# Altium schematic sheet clock-distribution.SchDoc: Clock Distribution
size A3; DocumentNumber: 8; SheetNumber: 8; SheetTotal: 9
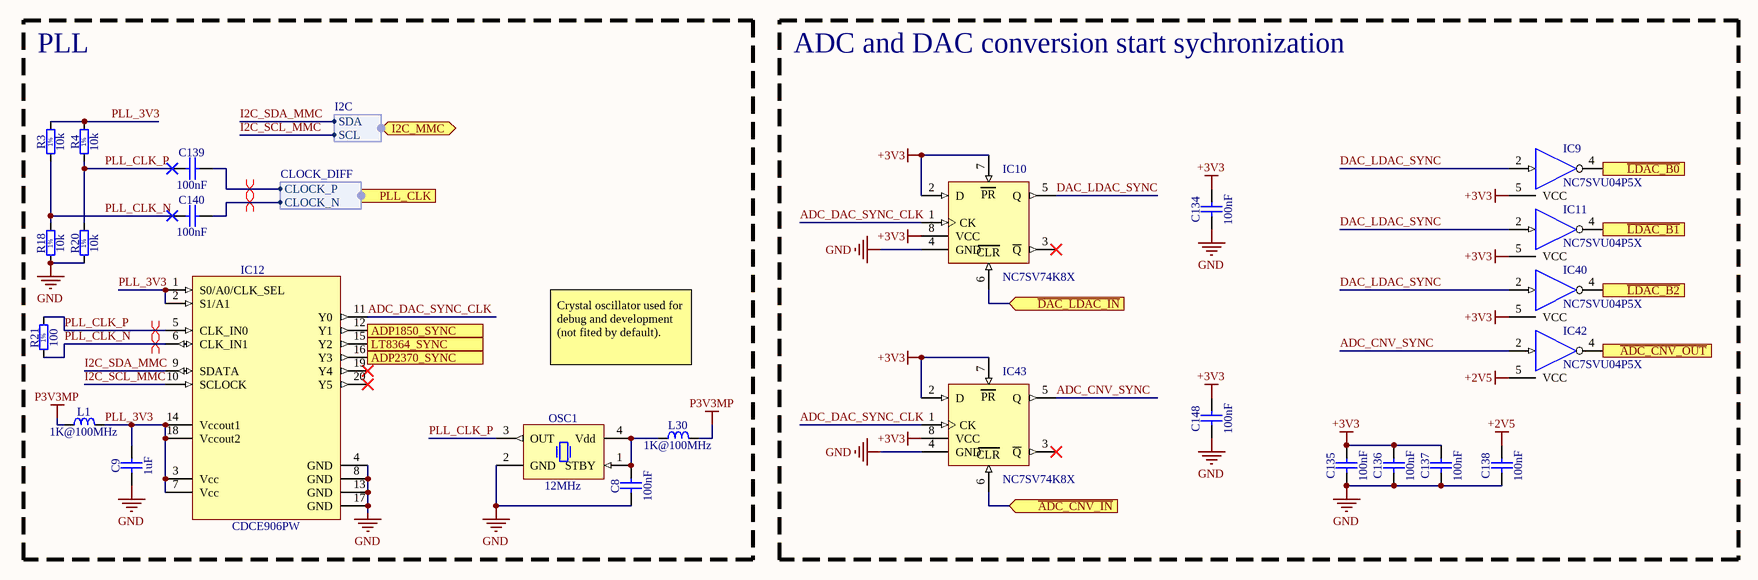
[diagram p0: clock-distribution.SchDoc]

## Parts
C8  100nF  [CAPC1005X55N]
C9  1uF  [CAPC2012X135N]
C134  100nF  [CAPC1005X55N]
C135  100nF  [CAPC1005X55N]
C136  100nF  [CAPC1005X55N]
C137  100nF  [CAPC1005X55N]
C138  100nF  [CAPC1005X55N]
C139  100nF  [CAPC1005X55N]
C140  100nF  [CAPC1005X55N]
C148  100nF  [CAPC1005X55N]
IC9  NC7SVU04P5X  [SOT65P210X110-5N]
IC10  NC7SV74K8X  [SOP50P310X90-8N]
IC11  NC7SVU04P5X  [SOT65P210X110-5N]
IC12  CDCE906PW  [SOP65P640X120-20N]
IC40  NC7SVU04P5X  [SOT65P210X110-5N]
IC42  NC7SVU04P5X  [SOT65P210X110-5N]
IC43  NC7SV74K8X  [SOP50P310X90-8N]
L1  1K@100MHz  [INDC1608X95N]
L30  1K@100MHz  [INDC1608X95N]
OSC1  12MHz  [XTAL_CONNOR_CS_LNLS]
R3  10k  [RESC1005X40N]
R4  10k  [RESC1005X40N]
R18  10k  [RESC1005X40N]
R20  10k  [RESC1005X40N]
R21  100  [RESC1005X40N]

## Blocks framed on the sheet
PLL: C8 C9 C139 C140 IC12 L1 L30 OSC1 R3 R4 R18 R20 R21
ADC and DAC conversion start sychronization: C134-C138 C148 IC9-IC11 IC40 IC42 IC43

## Ports
ADP1850_SYNC (out), ADP2370_SYNC (out), I2C_MMC (bidir, harness I2C), LT8364_SYNC (out), PLL_CLK (harness CLOCK_DIFF), ~{ADC_CNV_IN} (in), ~{ADC_CNV_OUT} (out), ~{DAC_LDAC_IN} (in), ~{LDAC_B0} (out), ~{LDAC_B1} (out), ~{LDAC_B2} (out)

## Harnesses
I2C: SDA, SCL
CLOCK_DIFF: CLOCK_P, CLOCK_N

## Nets
+2V5: C138.2 IC42.5(VCC)
+3V3: C134.2 C135.2 C136.2 C137.2 C148.2 IC9.5(VCC) IC10.2(D) IC10.7(~{PR}) IC10.8(VCC) IC11.5(VCC) IC40.5(VCC) IC43.2(D) IC43.7(~{PR}) IC43.8(VCC)
GND: C8.1 C9.1 C134.1 C135.1 C136.1 C137.1 C138.1 C148.1 IC9.3(GND) IC10.4(GND) IC11.3(GND) IC12.4(GND) IC12.8(GND) IC12.13(GND) IC12.17(GND) IC40.3(GND) IC42.3(GND) IC43.4(GND) OSC1.2(GND) R18.1 R20.1
P3V3MP: L1.1 L30.2
~{ADC_CNV_IN}: IC43.6(~{CLR}) ; port ~{ADC_CNV_IN}
~{ADC_CNV_OUT}: IC42.4(OUT) ; port ~{ADC_CNV_OUT}
ADC_CNV_SYNC: IC42.2(IN) IC43.5(Q)
ADC_DAC_SYNC_CLK: IC10.1(CK) IC12.11(Y0) IC43.1(CK)
ADP1850_SYNC: IC12.12(Y1) ; port ADP1850_SYNC
ADP2370_SYNC: IC12.16(Y3) ; port ADP2370_SYNC
~{DAC_LDAC_IN}: IC10.6(~{CLR}) ; port ~{DAC_LDAC_IN}
DAC_LDAC_SYNC: IC9.2(IN) IC10.5(Q) IC11.2(IN) IC40.2(IN)
I2C_SCL_MMC: IC12.10(SCLOCK) ; port I2C_MMC.SCL
I2C_SDA_MMC: IC12.9(SDATA) ; port I2C_MMC.SDA
~{LDAC_B0}: IC9.4(OUT) ; port ~{LDAC_B0}
~{LDAC_B1}: IC11.4(OUT) ; port ~{LDAC_B1}
~{LDAC_B2}: IC40.4(OUT) ; port ~{LDAC_B2}
LT8364_SYNC: IC12.15(Y2) ; port LT8364_SYNC
PLL_3V3: C9.2 IC12.1(S0/A0/CLK_SEL) IC12.2(S1/A1) IC12.3(Vcc) IC12.7(Vcc) IC12.14(Vccout1) IC12.18(Vccout2) L1.2 R3.2 R4.2
PLL_CLK_N: C140.1 IC12.6(CLK_IN1) R3.1 R18.2 R21.1
PLL_CLK_P: C139.1 IC12.5(CLK_IN0) OSC1.3(OUT) R4.1 R20.2 R21.2
NetC8_2: C8.2 L30.1 OSC1.1(STBY) OSC1.4(Vdd)
NetC139_2: C139.2 ; port PLL_CLK.CLOCK_P
NetC140_2: C140.2 ; port PLL_CLK.CLOCK_N

Not connected (* = marked no-connect by the designer): IC10 3(~{Q})*; IC12 19(Y4)* 20(Y5)*; IC43 3(~{Q})*

## Layout directives
differential pair; differential pair class DIFF100: NetC139_2, NetC140_2, PLL_CLK_N, PLL_CLK_P

## Notes on the sheet
- Crystal oscillator used for debug and development (not fited by default).
- Title:
- Date:
- Project:
- Drawn by:
- Time:
- Revision:
- Sheet
- of
- Grupo de Controles Avaçandos -
  GCA - LNLS
- Copyright CNPEM 2020.
  This documentation describes Open Hardware and is licensed under the CERN OHL S v2. You may redistribute and modify this documentation under the terms of the CERN OHL S v2. (https://www.ohwr.org/cernohl). This documentation is distributed WITHOUT ANY EXPRESS OR IMPLIED WARRANTY, INCLUDING OF MERCHANTABILITY, SATISFACTORY QUALITY AND FITNESS FOR A PARTICULAR PURPOSE. Please see the CERN OHL S v2 for applicable conditions.
- File:
- (in symbol NC7SV74K8X) PR; CLR
- (in symbol R0402_10K_1%_0.0625W_100PPM) 1%
- (in symbol R0402_100R_1%_0.0625W_100PPM) 1%

## Library data of the parts
C8 C134-C140 C148 = CC0402_100NF_16V_10%_X7R: SMD Multilayer Chip Ceramic Capacitor; Manufacturer: GENERIC; Manufacturer1 Part Number: GRM155R71C104KA88D; Voltage: 16V; TC: X7R; Tolerance: ±10%; Part Number: CC0402_100NF_16V_10%_X7R; Component Kind: Standard; Component Type: Standard; Pin Count: 2; Value: 100nF; Status: Not Recommended; Manufacturer Part Number: CC0402_100NF_16V_10%_X7R; Case: 0402; Mounted: Yes; Socket: No; SMD: Yes; Sense: No; Manufacturer1 Example: MURATA; Manufacturer1 ComponentHeight: 0.55mm; HelpURL: \\cern.ch\dfs\Applications\Altium\Datasheets\CC0402_X7R_MURATA_GRM.pdf; Author: CERN DEM JLC; CreateDate: 05/12/2013; LatestRevisionDate: 03/12/2007
C9 = CC0805_1UF_16V_10%_X7R: SMD Multilayer Chip Ceramic Capacitor; Manufacturer: GENERIC; Manufacturer1 Part Number: C2012X7R1C105K125AA; Voltage: 16V; TC: X7R; Tolerance: ±10%; Part Number: CC0805_1UF_16V_10%_X7R; Component Kind: Standard; Component Type: Standard; Pin Count: 2; Value: 1uF; Status: Preferred; Manufacturer Part Number: CC0805_1UF_16V_10%_X7R; Case: 0805; Mounted: Yes; Socket: No; SMD: Yes; Sense: No; Manufacturer1 Example: TDK; Manufacturer1 ComponentHeight: 1.45mm; HelpURL: \\cern.ch\dfs\Applications\Altium\Datasheets\CC0805_X7R_TDK_C.pdf; Author: CERN DEM JLC; CreateDate: 03/12/2007; LatestRevisionDate: 22/04/2015
IC9 IC11 IC40 IC42 = NC7SVU04P5X: TinyLogic® ULP-A Unbuffered Inverter; Manufacturer: FAIRCHILD SEMICONDUCTOR; PressFit: No; Bonding: No; Part Number: NC7SVU04P5X; Component Kind: Standard; Component Type: Standard; Device: NC7SVU04P5X; PackageDescription: SOT353, SC70-5, SOT, 0.65mm Pitch, 5 pin, 1.25mm W X 2.00mm L X 1.10mm H, IPC Medium Density; Manufacturer Part Number: NC7SVU04P5X; Pin Count: 5; Case: SOT353; Mounted: Yes; Socket: No; SMD: Yes; Sense: No; ComponentHeight: 1.1mm; Author: LNLS DIG LOS; CreateDate: 06/06/2018; LatestRevisionDate: 06/06/2018
IC10 IC43 = NC7SV74K8X: TinyLogic® ULP-A D-Type Flip-Flop with Preset and Clear; Manufacturer: FAIRCHILD SEMICONDUCTOR; PressFit: No; Bonding: No; Part Number: NC7SV74K8X; Component Kind: Standard; Component Type: Standard; Device: NC7SV74K8X; PackageDescription: SOP, 0.50mm pitch; 8 pin, 2.30mm W X 2.00mm L X 0.90mm H body, PC Medium Density; Manufacturer Part Number: NC7SV74K8X; Pin Count: 8; Case: TSSOP8; Mounted: Yes; Socket: No; SMD: Yes; Sense: No; ComponentHeight: 0.9mm; Author: LNLS DIG LOS; CreateDate: 06/06/2018; LatestRevisionDate: 06/06/2018
IC12 = CDCE906PW: Programmable 3-PLL clock synthesizer / Multiplier / Divider; Manufacturer: TEXAS INSTRUMENTS; PressFit: No; Bonding: No; Part Number: CDCE906PW; Component Kind: Standard; Component Type: Standard; Device: CDCE906PW; PackageDescription: SOP, 20-Leads, Body 6.5x4.4mm, Pitch 0.65mm, IPC Medium Density; Manufacturer Part Number: CDCE906PW; Pin Count: 20; Case: TSSOP20; Mounted: Yes; Socket: No; SMD: Yes; Sense: No; ComponentHeight: 1.2mm; Author: LNLS DIG LOS; CreateDate: 25/01/2018; LatestRevisionDate: 05/10/2021
L1 L30 = IND0603_MURATA_BLM18AG102SN1D: SMD EMIFIL Suppression Chip Ferrite Bead; Manufacturer: MURATA; Power: 400mA; Resistance: 0.50R; Tolerance: ±25%; Part Number: IND0603_MURATA_BLM18AG102SN1D; Component Kind: Standard; Component Type: Standard; Pin Count: 2; Value: 1K@100MHz; Status: None; Manufacturer Part Number: BLM18AG102SN1D; Case: 0603; Mounted: Yes; Socket: No; SMD: Yes; Sense: No; ComponentHeight: 0.95mm; Author: LNLS DIG GBMB; CreateDate: 03/11/2017; LatestRevisionDate: 03/11/2017
OSC1 = ASE-12-D-C-T: 3.3V CMOS SMD Crystal Oscillator; Manufacturer: ABRACON CORPORATION; PressFit: No; Bonding: No; Part Number: ASE-12-D-C-T; Component Kind: Standard; Component Type: Standard; PackageDescription: 4 Pins, 2.5x3.2mm, SMD Sealing Crystal, CS Serie; Value: 12MHz; Manufacturer Part Number: ASE-12-D-C-T; Pin Count: 4; Mounted: Yes; Socket: No; SMD: Yes; Sense: No; ComponentHeight: 1.2mm; Author: LNLS DIG LOS; CreateDate: 31/07/2017; LatestRevisionDate: 31/07/2017
R3 R4 R18 R20 = R0402_10K_1%_0.0625W_100PPM: General Purpose Thick Film Chip Resistor; Manufacturer: GENERIC; Manufacturer1 Part Number: 232270671003L; TC: ±100ppm/°C; Tolerance: ±1%; Part Number: R0402_10K_1%_0.0625W_100PPM; Component Kind: Standard; Component Type: Standard; Pin Count: 2; Value: 10k; Status: Not recommended; Power: 0.0625W; Manufacturer Part Number: R0402_10K_1%_0.0625W_100PPM; Case: 0402; Mounted: Yes; Sense: No; Socket: No; SMD: Yes; Manufacturer1 Example: YAGEO PHYCOMP; Manufacturer1 ComponentHeight: 0.4mm; HelpURL: \\cern.ch\dfs\Applications\Altium\Datasheets\R0402_Phycomp_RC0402.pdf; Author: CERN DEM JLC; CreateDate: 03/12/2007; LatestRevisionDate: 17/10/2012
R21 = R0402_100R_1%_0.0625W_100PPM: General Purpose Thick Film Chip Resistor; Manufacturer: GENERIC; Manufacturer1 Part Number: 232270671001L; TC: ±100ppm/°C; Tolerance: ±1%; Part Number: R0402_100R_1%_0.0625W_100PPM; Component Kind: Standard; Component Type: Standard; Pin Count: 2; Value: 100; Status: Not recommended; Power: 0.0625W; Manufacturer Part Number: R0402_100R_1%_0.0625W_100PPM; Case: 0402; Mounted: Yes; Socket: No; SMD: Yes; Manufacturer1 Example: YAGEO PHYCOMP; Manufacturer1 ComponentHeight: 0.4mm; HelpURL: \\cern.ch\dfs\Applications\Altium\Datasheets\R0402_Phycomp_RC0402.pdf; Author: CERN DEM JLC; CreateDate: 03/12/2007; LatestRevisionDate: 17/10/2012; Sense: No